# Altium schematic sheet 21FX_revd.SchDoc
size A
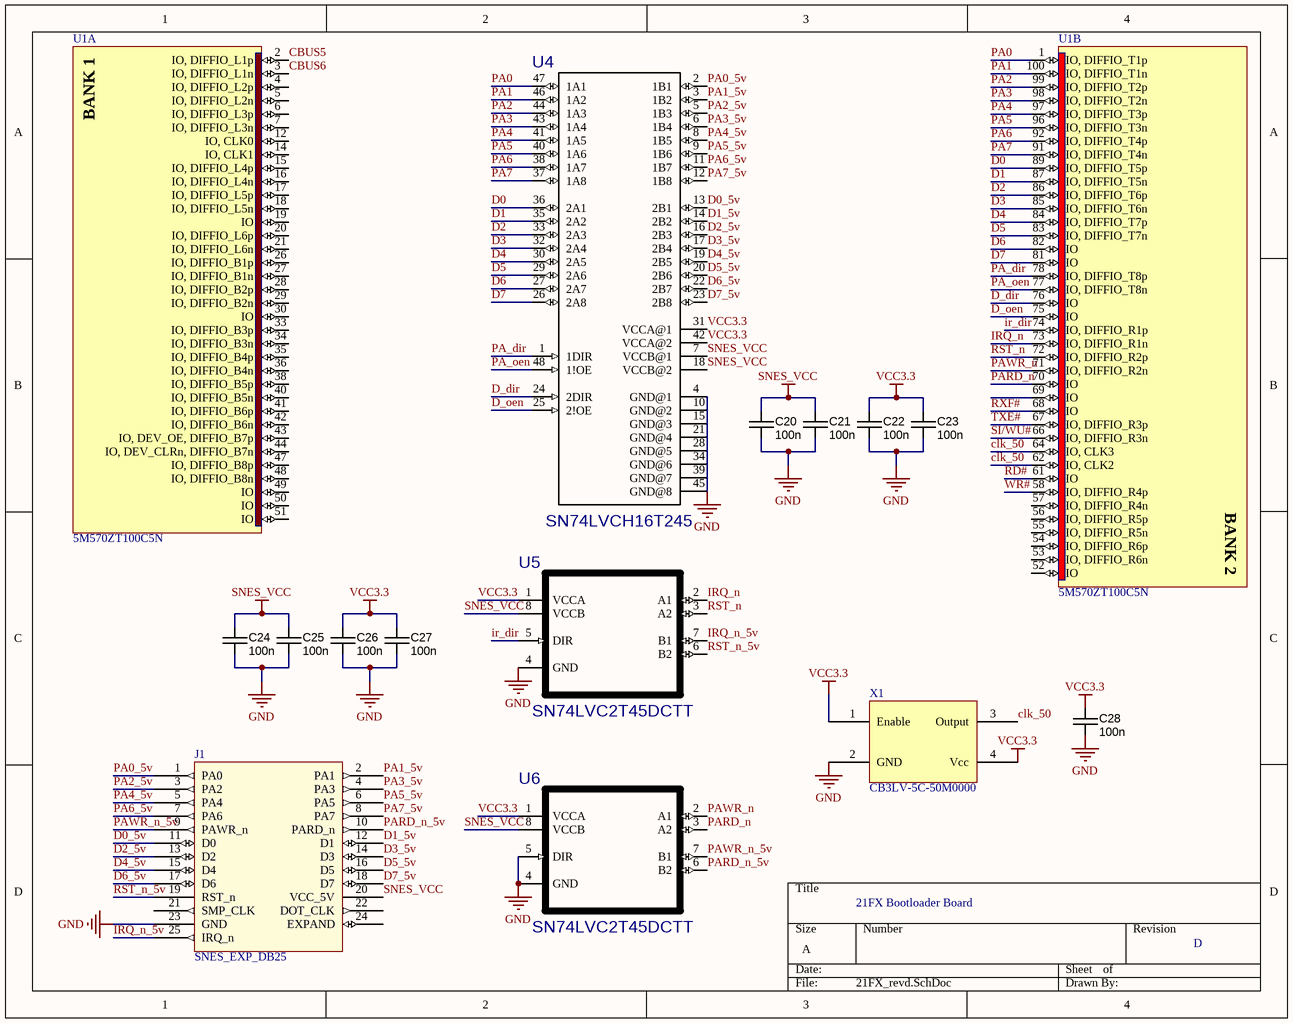
[diagram p0: 21FX_revd.SchDoc]

## Parts
C20  value 100n  [CAPC1608X90N]  (hidden comment: approved sub OK)
C21  value 100n  [CAPC1608X90N]  (hidden comment: approved sub OK)
C22  value 100n  [CAPC1608X90N]  (hidden comment: approved sub OK)
C23  value 100n  [CAPC1608X90N]  (hidden comment: approved sub OK)
C24  value 100n  [CAPC1608X90N]  (hidden comment: approved sub OK)
C25  value 100n  [CAPC1608X90N]  (hidden comment: approved sub OK)
C26  value 100n  [CAPC1608X90N]  (hidden comment: approved sub OK)
C27  value 100n  [CAPC1608X90N]  (hidden comment: approved sub OK)
C28  value 100n  [CAPC1608X90N]  (hidden comment: approved sub OK)
J1  SNES_EXP_DB25  [DB-25_RA_MPLUG]
U1  5M570ZT100C5N  [TQFP100_A-120_N]  (parts A,B of 4)
U4  SN74LVCH16T245  [TSSOP48]
U5  SN74LVC2T45DCTT  [SOP65P400X130-8N]
U6  SN74LVC2T45DCTT  [SOP65P400X130-8N]
X1  Manufacturer Part Number: CB3LV-5C-50M0000  [OSCILLATOR_7x5]  (hidden comment: CTX1282CT-ND)

## Nets
GND: C20.2 C21.2 C22.2 C23.2 C24.2 C25.2 C26.2 C27.2 C28.2 J1.23(GND) U4.4(GND@1) U4.10(GND@2) U4.15(GND@3) U4.21(GND@4) U4.28(GND@5) U4.34(GND@6) U4.39(GND@7) U4.45(GND@8) U5.4(GND) U6.4(GND) U6.5(DIR) X1.2(GND)
SNES_VCC: C20.1 C21.1 C24.1 C25.1 J1.20(VCC_5V) U4.7(VCCB@1) U4.18(VCCB@2) U5.8(VCCB) U6.8(VCCB)
VCC3.3: C22.1 C23.1 C26.1 C27.1 C28.1 U4.31(VCCA@1) U4.42(VCCA@2) U5.1(VCCA) U6.1(VCCA) X1.1(Enable) X1.4(Vcc)
CBUS5: U1.2(IO,_DIFFIO_L1p)
CBUS6: U1.3(IO,_DIFFIO_L1n)
clk_50: U1.62(IO,_CLK2) U1.64(IO,_CLK3) X1.3(Output)
D0: U1.89(IO,_DIFFIO_T5p) U4.36(2A1)
D0_5v: J1.11(D0) U4.13(2B1)
D1: U1.87(IO,_DIFFIO_T5n) U4.35(2A2)
D1_5v: J1.12(D1) U4.14(2B2)
D2: U1.86(IO,_DIFFIO_T6p) U4.33(2A3)
D2_5v: J1.13(D2) U4.16(2B3)
D3: U1.85(IO,_DIFFIO_T6n) U4.32(2A4)
D3_5v: J1.14(D3) U4.17(2B4)
D4: U1.84(IO,_DIFFIO_T7p) U4.30(2A5)
D4_5v: J1.15(D4) U4.19(2B5)
D5: U1.83(IO,_DIFFIO_T7n) U4.29(2A6)
D5_5v: J1.16(D5) U4.20(2B6)
D6: U1.82(IO) U4.27(2A7)
D6_5v: J1.17(D6) U4.22(2B7)
D7: U1.81(IO) U4.26(2A8)
D7_5v: J1.18(D7) U4.23(2B8)
D_dir: U1.76(IO) U4.24(2DIR)
D_oen: U1.75(IO) U4.25(2!OE)
ir_dir: U1.74(IO,_DIFFIO_R1p) U5.5(DIR)
IRQ_n: U1.73(IO,_DIFFIO_R1n) U5.2(A1)
IRQ_n_5v: J1.25(IRQ_n) U5.7(B1)
PA0: U1.1(IO,_DIFFIO_T1p) U4.47(1A1)
PA0_5v: J1.1(PA0) U4.2(1B1)
PA1: U1.100(IO,_DIFFIO_T1n) U4.46(1A2)
PA1_5v: J1.2(PA1) U4.3(1B2)
PA2: U1.99(IO,_DIFFIO_T2p) U4.44(1A3)
PA2_5v: J1.3(PA2) U4.5(1B3)
PA3: U1.98(IO,_DIFFIO_T2n) U4.43(1A4)
PA3_5v: J1.4(PA3) U4.6(1B4)
PA4: U1.97(IO,_DIFFIO_T3p) U4.41(1A5)
PA4_5v: J1.5(PA4) U4.8(1B5)
PA5: U1.96(IO,_DIFFIO_T3n) U4.40(1A6)
PA5_5v: J1.6(PA5) U4.9(1B6)
PA6: U1.92(IO,_DIFFIO_T4p) U4.38(1A7)
PA6_5v: J1.7(PA6) U4.11(1B7)
PA7: U1.91(IO,_DIFFIO_T4n) U4.37(1A8)
PA7_5v: J1.8(PA7) U4.12(1B8)
PA_dir: U1.78(IO,_DIFFIO_T8p) U4.1(1DIR)
PA_oen: U1.77(IO,_DIFFIO_T8n) U4.48(1!OE)
PARD_n: U1.70(IO) U6.3(A2)
PARD_n_5v: J1.10(PARD_n) U6.6(B2)
PAWR_n: U1.71(IO,_DIFFIO_R2n) U6.2(A1)
PAWR_n_5v: J1.9(PAWR_n) U6.7(B1)
RD#: U1.61(IO)
RST_n: U1.72(IO,_DIFFIO_R2p) U5.3(A2)
RST_n_5v: J1.19(RST_n) U5.6(B2)
RXF#: U1.68(IO)
SI/WU#: U1.66(IO,_DIFFIO_R3n)
TXE#: U1.67(IO,_DIFFIO_R3p)
WR#: U1.58(IO,_DIFFIO_R4p)

Not connected (* = marked no-connect by the designer): J1 21(SMP_CLK) 22(DOT_CLK) 24(EXPAND); U1 4(IO,_DIFFIO_L2p) 5(IO,_DIFFIO_L2n) 6(IO,_DIFFIO_L3p) 7(IO,_DIFFIO_L3n) 12(IO,_CLK0) 14(IO,_CLK1) 15(IO,_DIFFIO_L4p) 16(IO,_DIFFIO_L4n) 17(IO,_DIFFIO_L5p) 18(IO,_DIFFIO_L5n) 19(IO) 20(IO,_DIFFIO_L6p) 21(IO,_DIFFIO_L6n) 26(IO,_DIFFIO_B1p) 27(IO,_DIFFIO_B1n) 28(IO,_DIFFIO_B2p) 29(IO,_DIFFIO_B2n) 30(IO) 33(IO,_DIFFIO_B3p) 34(IO,_DIFFIO_B3n) 35(IO,_DIFFIO_B4p) 36(IO,_DIFFIO_B4n) 38(IO,_DIFFIO_B5p) 40(IO,_DIFFIO_B5n) 41(IO,_DIFFIO_B6p) 42(IO,_DIFFIO_B6n) 43(IO,_DEV_OE,_DIFFIO_B7p) 44(IO,_DEV_CLRn,_DIFFIO_B7n) 47(IO,_DIFFIO_B8p) 48(IO,_DIFFIO_B8n) 49(IO) 50(IO) 51(IO) 52(IO) 53(IO,_DIFFIO_R6n) 54(IO,_DIFFIO_R6p) 55(IO,_DIFFIO_R5n) 56(IO,_DIFFIO_R5p) 57(IO,_DIFFIO_R4n) 69(IO)

## Notes on the sheet
- 21FX Bootloader Board
- D
- (in symbol 5M570ZT100C5N, part A) BANK 1
- (in symbol 5M570ZT100C5N, part B) BANK 2

## Library data of the parts
C20-C28 = CAPC_100n_0603_X7R_50V_10%: Capacitor SMD Cer 100nF 10% 50V X7R 0603; Manufacturer 1: AVX Corporation; Manufacturer Part Number 1: 06035C104KAT2A; Ratings: 50V; X7R; Material: ceramic; SCDType: spec; Manufacturer 2: TDK Corporation; Manufacturer Part Number 2: C1608X7R1H104K; Package / Case: 0603 (1608 Metric); Tolerance: ±10%; Supplier 1: Digi-Key; Supplier Part Number 1: 478-5052-1-ND; ComponentLink1URL: http://www.avx.com/docs/Catalogs/cx7r.pdf; ComponentLink1Description: http://www.avx.com/docs/Catalogs/cx7r.pdf; Supplier 2: Digi-Key; Supplier Part Number 2: 445-1314-1-ND; ComponentLink2URL: http://product.tdk.com/capacitor/mlcc/en/documents/mlcc_commercial_general_en.pdf; ComponentLink2Description: http://product.tdk.com/capacitor/mlcc/en/documents/mlcc_commercial_general_en.pdf
U1 = 5M570ZT100C5N: MAX V 1.8V CPLD, 74 IOs, 570 Logic Elements, 100-Pin TQFP, Commercial Temperature, Speed Grade 5, Pb-Free; DatasheetVersion: ver1.2, May-2011; PackageVersion: ver1.0, Jul-2011; PackageReference: TQFP100_A-120; PackageDescription: 100-Pin Plastic Thin Quad Flat Pack (TQFP) - Wire Bond - A:1.20; Code_JEDEC: MS-029-AED; ComponentLink1Description: Manufacturer URL; ComponentLink1URL: http://www.altera.com/; ComponentLink2Description: Datasheet; ComponentLink2URL: http://www.altera.com/literature/hb/max-v/max5_handbook.pdf; ComponentLink3Description: MAX V Device Pin-Out files; ComponentLink3URL: http://www.altera.com/literature/lit-dp.jsp?category=MAX%205&showspreadsheet=y; ComponentLink4Description: Package Specification; ComponentLink4URL: http://www.altera.com/devicepackaging/04R00365-01.pdf
X1 = CTX1282CT-ND_50MHz: 50 MHz 3.3v Oscillator; Manufacturer: CTS-Frequency Controls; Frequency: 50MHz; Function: Tri-State (Output Enable); Output: HCMOS, TTL; Frequency Stability: ±25ppm; Current - Supply (Max): 40mA; Current - Supply (Disable) (Max): 10µA; Supplier 1: Digi-Key; RoHS: RoHS Compliant; Category: Crystals and Oscillators; Stock 1: 628; Pricing 1: 1=1.43, 10=1.374, 50=1.3436, 100=1.1491, 500=1.11872 (USD); Packaging: Cut Tape (CT); Type: XO (Standard); Voltage - Supply: 3.3V; Operating Temperature: -20°C ~ 70°C; Ratings: -; Mounting Type: Surface Mount; Size / Dimension: 0.276" L x 0.197" W (7.00mm x 5.00mm); Height: 0.071" (1.80mm); Package / Case: 4-SMD, No Lead (DFN, LCC); ComponentLink1URL: http://www.ctscorp.com/wp-content/uploads/2015/11/008-0256-0.pdf; ComponentLink1Description: http://www.ctscorp.com/wp-content/uploads/2015/11/008-0256-0.pdf; Supplier Part Number 1: CTX1282CT-ND
U4 = SN74LVCH16T245: Value: *
U5 U6 = SN74LVC2T45DCTT: Value: *